# Altium schematic sheet [07]COMM_BOARD.SchDoc
size A4
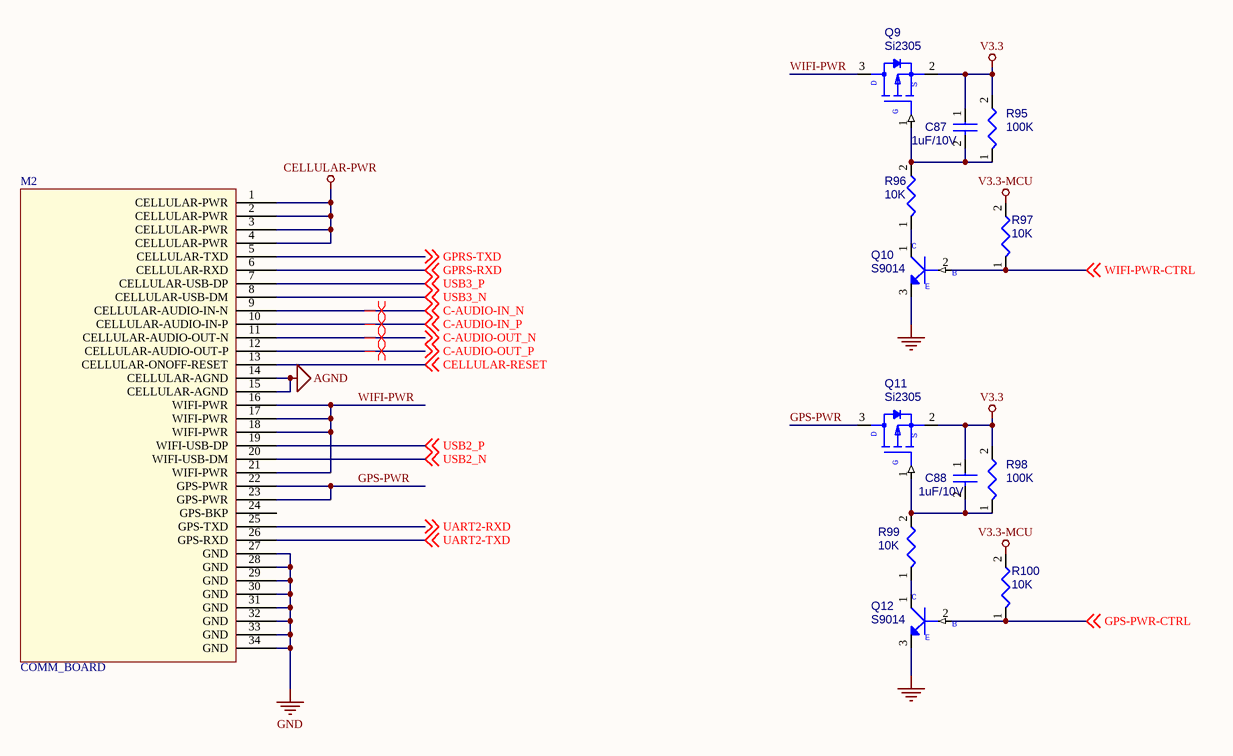
[diagram p0: [07]COMM_BOARD.SchDoc]

## Parts
C87  1uF/10V  [0603]
C88  1uF/10V  [0603]
M2  COMM_BOARD
Q9  Si2305  [MOSFET]
Q10  S9014  [NPN]
Q11  Si2305  [MOSFET]
Q12  S9014  [NPN]
R95  100K  [0603]
R96  10K  [0603]
R97  10K  [0603]
R98  100K  [0603]
R99  10K  [0603]
R100  10K  [0603]

## Nets
AGND: M2.14(CELLULAR-AGND) M2.15(CELLULAR-AGND)
CELLULAR-PWR: M2.1(CELLULAR-PWR) M2.2(CELLULAR-PWR) M2.3(CELLULAR-PWR) M2.4(CELLULAR-PWR)
GND: M2.27(GND) M2.28(GND) M2.29(GND) M2.30(GND) M2.31(GND) M2.32(GND) M2.33(GND) M2.34(GND) Q10.3(EMITTER) Q12.3(EMITTER)
V3.3: C87.1 C88.1 Q9.2(S) Q11.2(S) R95.2 R98.2
V3.3-MCU: R97.2 R100.2
C-AUDIO-IN_N: M2.9(CELLULAR-AUDIO-IN-N) ; off-sheet C-AUDIO-IN_N
C-AUDIO-IN_P: M2.10(CELLULAR-AUDIO-IN-P) ; off-sheet C-AUDIO-IN_P
C-AUDIO-OUT_N: M2.11(CELLULAR-AUDIO-OUT-N) ; off-sheet C-AUDIO-OUT_N
C-AUDIO-OUT_P: M2.12(CELLULAR-AUDIO-OUT-P) ; off-sheet C-AUDIO-OUT_P
CELLULAR-RESET: M2.13(CELLULAR-ONOFF-RESET) ; off-sheet CELLULAR-RESET
GPRS-RXD: M2.6(CELLULAR-RXD) ; off-sheet GPRS-RXD
GPRS-TXD: M2.5(CELLULAR-TXD) ; off-sheet GPRS-TXD
GPS-PWR: M2.22(GPS-PWR) M2.23(GPS-PWR) Q11.3(D)
GPS-PWR-CTRL: Q12.2(BASE) R100.1 ; off-sheet GPS-PWR-CTRL
UART2-RXD: M2.25(GPS-TXD) ; off-sheet UART2-RXD
UART2-TXD: M2.26(GPS-RXD) ; off-sheet UART2-TXD
USB2_N: M2.20(WIFI-USB-DM) ; off-sheet USB2_N
USB2_P: M2.19(WIFI-USB-DP) ; off-sheet USB2_P
USB3_N: M2.8(CELLULAR-USB-DM) ; off-sheet USB3_N
USB3_P: M2.7(CELLULAR-USB-DP) ; off-sheet USB3_P
WIFI-PWR: M2.16(WIFI-PWR) M2.17(WIFI-PWR) M2.18(WIFI-PWR) M2.21(WIFI-PWR) Q9.3(D)
WIFI-PWR-CTRL: Q10.2(BASE) R97.1 ; off-sheet WIFI-PWR-CTRL
NetC87_2: C87.2 Q9.1(G) R95.1 R96.2
NetC88_2: C88.2 Q11.1(G) R98.1 R99.2
NetQ10_1: Q10.1(COLLECTOR) R96.1
NetQ12_1: Q12.1(COLLECTOR) R99.1

Not connected (* = marked no-connect by the designer): M2 24(GPS-BKP)

## Layout directives
differential pair: C-AUDIO-IN_N, C-AUDIO-IN_P, C-AUDIO-OUT_N, C-AUDIO-OUT_P

## Notes on the sheet
- (in symbol MMBT3904_NL_SOT23-3) C; B; E

## Library data of the parts
C87 C88 = P_CAP NP
Q9 Q11 = AO3401L_SOT23-3_0: Part Number: SB934010010; ROOM: USB POWER; Part Value: AO3401L_SOT23-3
Q10 Q12 = MMBT3904_NL_SOT23-3: Part Description: S TR MMBT3904_NL NPN SOT23; Part Number: SB039040000
R95 R96 R98 R99 = P_R: Part Number: SD013100A8L; OEM Part Number: F9; Manufacturer Part number: null; Part Description: S RES 1/10W 10 +-5% 0603; Ecology: YES; Function Field: 31.2; AP: NA; ROOM: GPS; Lead Free: MY; Part Type: RESISTOR; AP Sheet: http://ISPDPRD/Windchill/servlet/WindchillAuthGW/wt.enterprise.URLProcessor/URLTemplateAction?u8&oid=VR%3Aext.compal.part.CompalPart%3A365727415&action=ObjProps
R97 R100 = R_Dup1